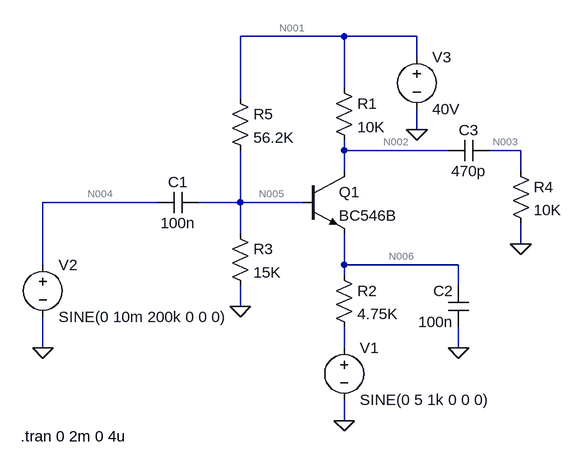
[diagram p0: schematic am.asc]
am.asc, the LTspice schematic file:
Version 4
SHEET 1 880 680
WIRE 208 -112 48 -112
WIRE 320 -112 208 -112
WIRE 320 -80 320 -112
WIRE 208 -32 208 -112
WIRE 48 -16 48 -112
WIRE 320 32 320 0
WIRE 208 64 208 48
WIRE 368 64 208 64
WIRE 480 64 432 64
WIRE 208 96 208 64
WIRE 480 96 480 64
WIRE -80 144 -256 144
WIRE 48 144 48 64
WIRE 48 144 -16 144
WIRE 144 144 48 144
WIRE 48 192 48 144
WIRE 480 208 480 176
WIRE -256 240 -256 144
WIRE 208 240 208 192
WIRE 384 240 208 240
WIRE 208 256 208 240
WIRE 384 272 384 240
WIRE 48 304 48 272
WIRE -256 368 -256 320
WIRE 208 368 208 336
WIRE 384 368 384 336
WIRE 208 480 208 448
FLAG 208 480 0
FLAG -256 368 0
FLAG 48 304 0
FLAG 384 368 0
FLAG 480 208 0
FLAG 320 32 0
SYMBOL npn 144 96 R0
SYMATTR InstName Q1
SYMATTR Value BC546B
SYMBOL res 192 -48 R0
SYMATTR InstName R1
SYMATTR Value 10K
SYMATTR SpiceLine tol=1 pwr=0.1
SYMBOL res 192 240 R0
SYMATTR InstName R2
SYMATTR Value 4.75K
SYMATTR SpiceLine tol=1 pwr=0.1
SYMBOL voltage 208 352 R0
WINDOW 123 0 0 Left 2
WINDOW 39 0 0 Left 2
SYMATTR InstName V1
SYMATTR Value SINE(0 5 1k 0 0 0)
SYMBOL cap -16 128 R90
WINDOW 0 0 32 VBottom 2
WINDOW 3 32 32 VTop 2
SYMATTR InstName C1
SYMATTR Value 100n
SYMATTR SpiceLine V=100 Irms=4.58 Rser=0.025 Lser=0 mfg="KEMET" pn="C2225C105K1RAC" type="X7R"
SYMBOL voltage -256 224 R0
WINDOW 123 0 0 Left 2
WINDOW 39 0 0 Left 2
SYMATTR InstName V2
SYMATTR Value SINE(0 10m 200k 0 0 0)
SYMBOL res 32 176 R0
SYMATTR InstName R3
SYMATTR Value 15K
SYMATTR SpiceLine tol=1 pwr=0.1
SYMBOL res 464 80 R0
SYMATTR InstName R4
SYMATTR Value 10K
SYMATTR SpiceLine tol=1 pwr=0.1
SYMBOL voltage 320 -96 R0
WINDOW 123 0 0 Left 2
WINDOW 39 0 0 Left 2
SYMATTR InstName V3
SYMATTR Value 40V
SYMBOL res 32 -32 R0
SYMATTR InstName R5
SYMATTR Value 56.2K
SYMATTR SpiceLine tol=1 pwr=0.1
SYMBOL cap 400 336 R180
WINDOW 0 24 56 Left 2
WINDOW 3 24 8 Left 2
SYMATTR InstName C2
SYMATTR Value 100n
SYMATTR SpiceLine V=100 Irms=4.58 Rser=0.025 Lser=0 mfg="KEMET" pn="C2225C105K1RAC" type="X7R"
SYMBOL cap 432 48 R90
WINDOW 0 0 32 VBottom 2
WINDOW 3 32 32 VTop 2
SYMATTR InstName C3
SYMATTR Value 470p
SYMATTR SpiceLine V=100 Irms=4.58 Rser=0.025 Lser=0
TEXT -290 504 Left 2 !.tran 0 2m 0 4u

The netlist it stands for:
* am.asc
Q1 N002 N005 N006 0 BC546B
R1 N001 N002 10K tol=1 pwr=0.1
R2 N006 N007 4.75K tol=1 pwr=0.1
V1 N007 0 SINE(0 5 1k 0 0 0)
C1 N005 N004 100n V=100 Irms=4.58 Rser=0.025 Lser=0 mfg="KEMET" pn="C2225C105K1RAC" type="X7R"
V2 N004 0 SINE(0 10m 200k 0 0 0)
R3 N005 0 15K tol=1 pwr=0.1
R4 N003 0 10K tol=1 pwr=0.1
V3 N001 0 40V
R5 N001 N005 56.2K tol=1 pwr=0.1
C2 0 N006 100n V=100 Irms=4.58 Rser=0.025 Lser=0 mfg="KEMET" pn="C2225C105K1RAC" type="X7R"
C3 N003 N002 470p V=100 Irms=4.58 Rser=0.025 Lser=0
.model NPN NPN
.model PNP PNP
.lib standard.bjt
.tran 0 2m 0 4u
.backanno
.end

* Results of the author's LTspice run, read from the files saved beside the schematic
* Operating Point, zero values left out:
*   V(n002) = 23.78 V
*   V(n005) = 8.372 V
*   V(n006) = 7.726 V
*   V(n001) = 40 V
*   Ic(Q1) = 1.622 mA
*   Ib(Q1) = 4.604 µA
*   Ie(Q1) = -1.627 mA
*   I(R5) = 562.8 µA
*   I(R3) = 558.2 µA
*   I(R2) = 1.627 mA
*   I(R1) = 1.622 mA
*   I(V3) = -2.185 mA
*   I(V1) = 1.627 mA
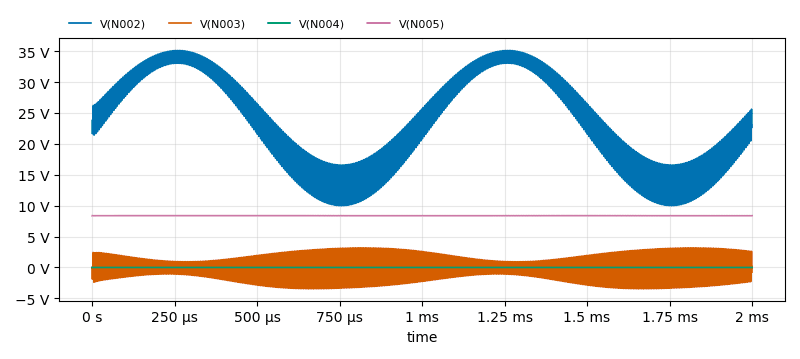
[diagram p1: Transient Analysis of am.asc, plotted from the saved traces]
* Transient Analysis, 1 run:
*   V(N002): min 9.981 V, max 35.12 V, average 23.77 V, rms 24.94 V, last 22.67 V
*   V(N003): min -3.453 V, max 3.174 V, average -9.312 mV, rms 1.714 V, last -755.8 mV
*   V(N004): min -9.975 mV, max 9.969 mV, average 702.9 nV, rms 7.051 mV, last 0 V
*   V(N005): min 8.355 V, max 8.391 V, average 8.373 V, rms 8.373 V, last 8.365 V